# EAGLE schematic Left Ear Board (EAGLE 8.5.0)
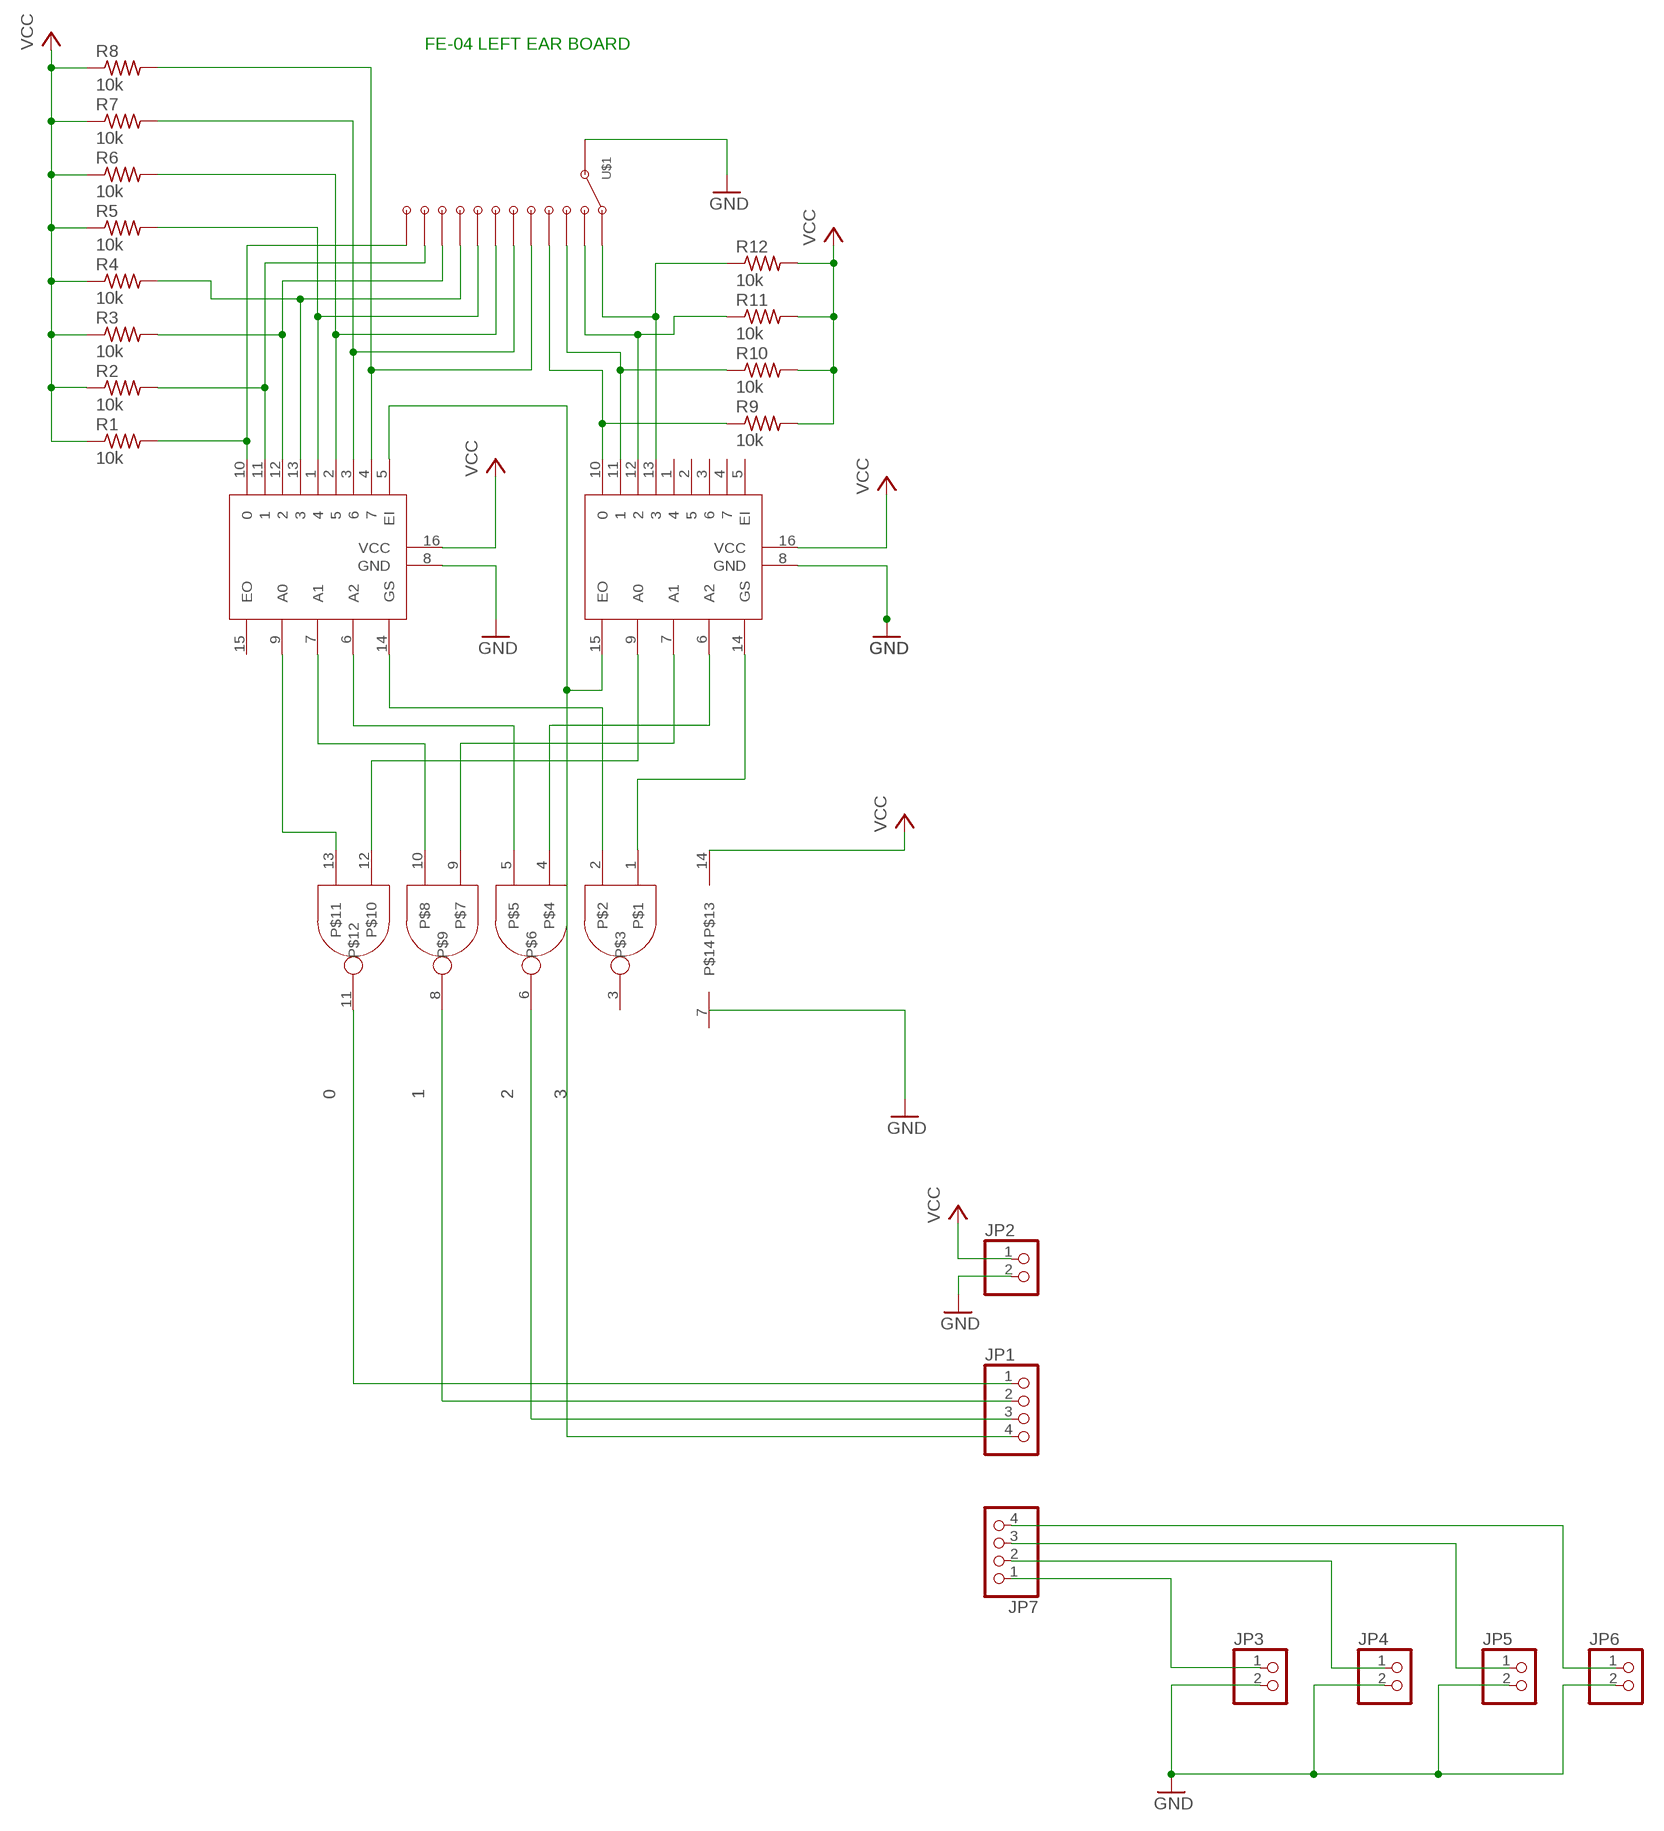
[diagram p0: schematic, sheet 1]

## Parts
JP1  PINHD-1X4  [1X04]
JP2  PINHD-1X2  [1X02]
JP3  PINHD-1X2  [1X02]
JP4  PINHD-1X2  [1X02]
JP5  PINHD-1X2  [1X02]
JP6  PINHD-1X2  [1X02]
JP7  PINHD-1X4  [1X04]
R1  10k  R-US_R0603  [R0603]
R2  10k  R-US_R0603  [R0603]
R3  10k  R-US_R0603  [R0603]
R4  10k  R-US_R0603  [R0603]
R5  10k  R-US_R0603  [R0603]
R6  10k  R-US_R0603  [R0603]
R7  10k  R-US_R0603  [R0603]
R8  10k  R-US_R0603  [R0603]
R9  10k  R-US_R0603  [R0603]
R10  10k  R-US_R0603  [R0603]
R11  10k  R-US_R0603  [R0603]
R12  10k  R-US_R0603  [R0603]
U$1  12-POSITION-ROTARY  [MC00L1NCQF]
U$2  SN74LS148D  [SOIC-16]
U$3  SN74LS148D  [SOIC-16]
U$4  QUAD_NAND  [SOIC-14]

## Nets
0: JP1.1 U$4.11
1: JP1.2 U$4.8
2: JP1.3 U$4.6
3: JP1.4 U$2.5(EI) U$3.15(EO)
GND: JP2.2 JP3.2 JP4.2 JP5.2 JP6.2 U$1.P$13(WIPER) U$2.8(GND) U$3.8(GND)
N$1: R1.2 U$1.P$12(PIN12) U$2.10
N$2: U$2.9(A0) U$4.13
N$3: U$3.9(A0) U$4.12
N$4: U$2.7(A1) U$4.10
N$5: U$3.7(A1) U$4.9
N$6: U$2.6(A2) U$4.5
N$7: U$3.6(A2) U$4.4
N$8: U$2.14(GS) U$4.2
N$9: U$3.14(GS) U$4.1
N$10: R9.1 U$1.P$4(PIN4) U$3.10
N$11: R10.1 U$1.P$3(PIN3) U$3.11
N$12: R11.1 U$1.P$2(PIN2) U$3.12
N$13: R12.1 U$1.P$1(PIN1) U$3.13
N$14: R2.2 U$1.P$11(PIN11) U$2.11
N$15: R3.2 U$1.P$10(PIN10) U$2.12
N$16: R4.2 U$1.P$9(PIN9) U$2.13
N$17: R5.2 U$1.P$8(PIN8) U$2.1
N$18: R6.2 U$1.P$7(PIN7) U$2.2
N$19: R7.2 U$1.P$6(PIN6) U$2.3
N$20: R8.2 U$1.P$5(PIN5) U$2.4
N$21: JP3.1 JP7.1
N$22: JP4.1 JP7.2
N$23: JP5.1 JP7.3
N$24: JP6.1 JP7.4
VCC: JP2.1 R1.1 R2.1 R3.1 R4.1 R5.1 R6.1 R7.1 R8.1 R9.2 R10.2 R11.2 R12.2 U$2.16(VCC) U$3.16(VCC) U$4.14
Unconnected: U$2.15(EO) U$3.1 U$3.2 U$3.3 U$3.4 U$3.5(EI) U$4.3 U$4.7

## Notes on the sheet
- FE-04 LEFT EAR BOARD

## Library data of the parts
JP1 JP7 = pinhead:PINHD-1X4: PIN HEADER
JP2-JP6 = pinhead:PINHD-1X2: PIN HEADER
R1-R12 = rcl:R-US_: RESISTOR, American symbol; PARTNO: ERJ-3EKF2201V
U$1 = FormE:12-POSITION-ROTARY: 12 Position Rotary Switch https://www.digikey.com/product-detail/en/c-k/MC00L1NCQF/CKN11089-ND/3754082
U$2 U$3 = FormE:SN74LS148D: IC PRIORITY ENCODER 8-3L 16-SOIC
U$4 = FormE:QUAD_NAND